# Altium schematic sheet BSPD.SchDoc
size A4
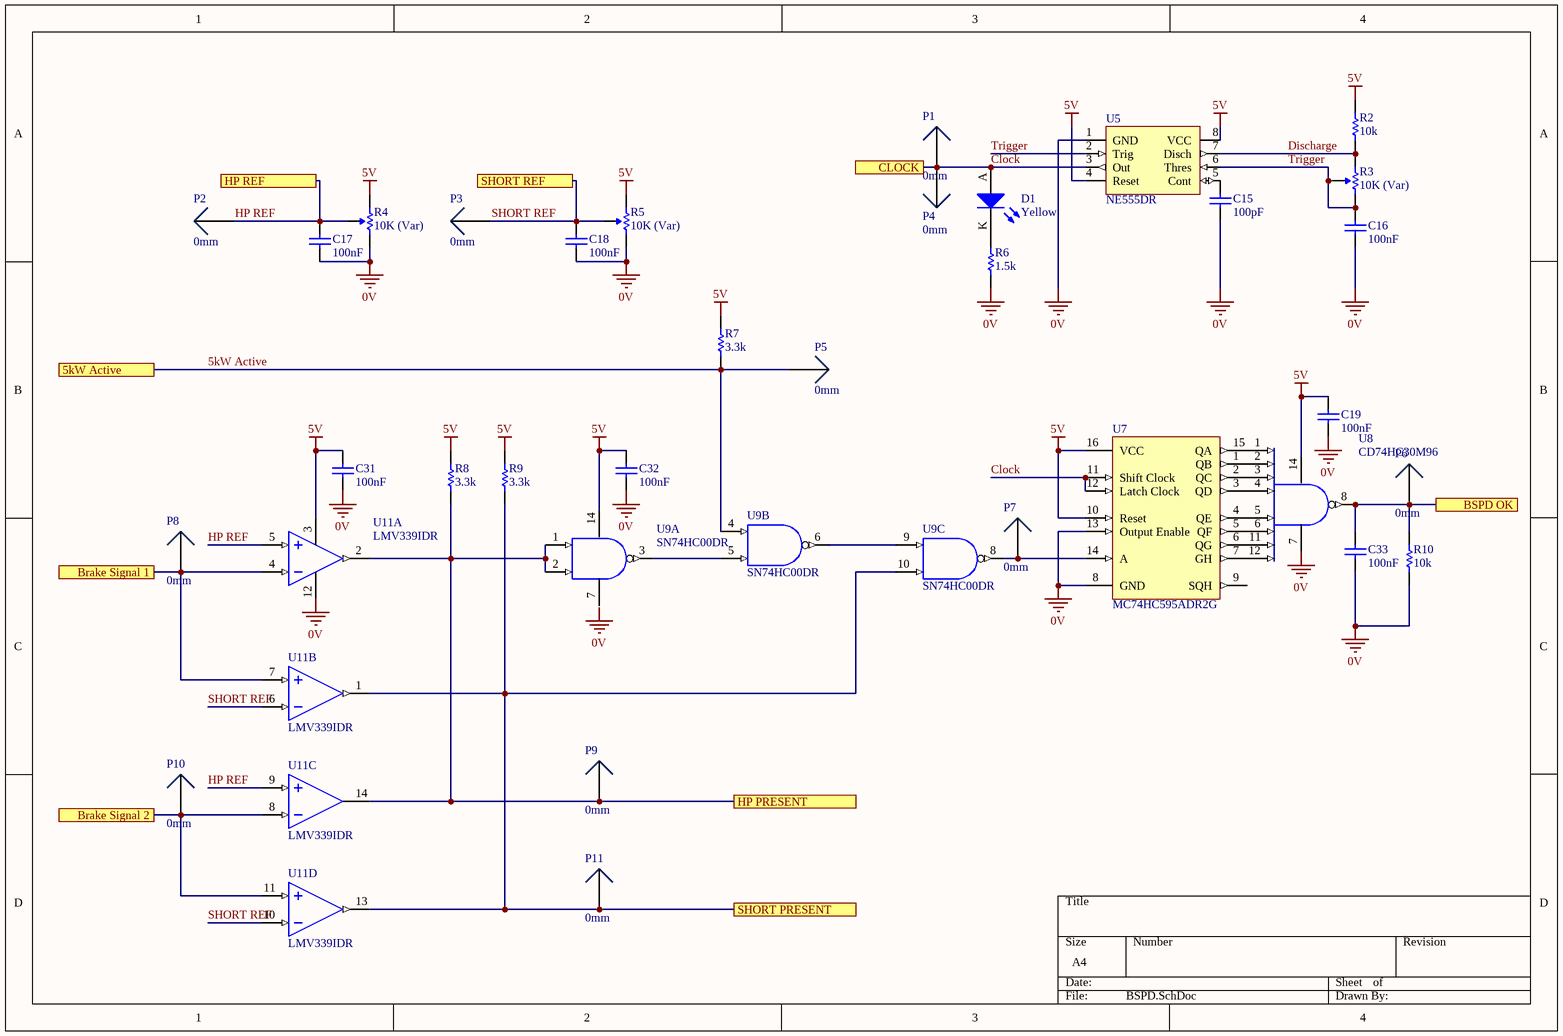
[diagram p0: BSPD.SchDoc]

## Parts
C15  100pF  [0805]
C16  100nF  [0805]
C17  100nF  [0805]
C18  100nF  [0805]
C19  100nF  [0805]
C31  100nF  [0805]
C32  100nF  [0805]
C33  100nF  [0805]
D1  Yellow  [0805 LED]
P1  0mm  [SMD Test Point]
P2  0mm  [TH Test Point]
P3  0mm  [TH Test Point]
P4  0mm  [TH Test Point]
P5  0mm  [SMD Test Point]
P6  0mm  [SMD Test Point]
P7  0mm  [SMD Test Point]
P8  0mm  [TH Test Point]
P9  0mm  [SMD Test Point]
P10  0mm  [TH Test Point]
P11  0mm  [SMD Test Point]
R2  10k  [0805]
R3  10K (Var)  [B 3296]
R4  10K (Var)  [B 3296]
R5  10K (Var)  [B 3296]
R6  1.5k  [0805]
R7  3.3k  [0805]
R8  3.3k  [0805]
R9  3.3k  [0805]
R10  10k  [0805]
U5  NE555DR  [TI 8-SOIC]
U7  MC74HC595ADR2G  [ON 16-SOIC]
U8  CD74HC30M96  [TI 14-SOIC]
U9  SN74HC00DR  [TI 14-SOIC]  (parts A,B,C of 4)
U11  LMV339IDR  [TI 14-SOIC]  (parts A,B,C,D of 4)

## Ports
5kW Active, Brake Signal 1, Brake Signal 2, BSPD OK, CLOCK, HP PRESENT, HP REF, SHORT PRESENT, SHORT REF

## Nets
0V: C15.1 C16.1 C17.1 C18.1 C19.1 C31.1 C32.1 C33.1 R4.1(CCW) R5.1(CCW) R6.1 R10.1 U5.1(GND) U7.8(GND) U7.13(Output_Enable) U8.7(GND) U11.12(V-)
5V: C19.2 C31.2 C32.2 R2.2 R4.3(CW) R5.3(CW) R7.2 R8.2 R9.2 U5.4(Reset) U5.8(VCC) U7.10(Reset) U7.16(VCC) U8.14(VCC) U9.14(VCC) U11.3(V+)
5kW Active: P5.1 R7.1 U9.4(2A) ; port 5kW Active
Brake Signal 1: P8.1 U11.4(IN_A-) U11.7(IN_B+) ; port Brake Signal 1
Brake Signal 2: P10.1 U11.8(IN_C-) U11.11(IN_D+) ; port Brake Signal 2
BSPD OK: C33.2 P6.1 R10.2 U8.8(Output) ; port BSPD OK
Clock: D1.A P1.1 P4.1 U5.3(Out) U7.11(Shift_Clock) U7.12(Latch_Clock) ; port CLOCK
Discharge: R2.1 R3.3(CW) U5.7(Disch)
HP PRESENT: P9.1 R8.1 U9.1(1A) U9.2(1B) U11.2(OUT_A) U11.14(OUT_C) ; port HP PRESENT
HP REF: C17.2 P2.1 R4.2(Wiper) U11.5(IN_A+) U11.9(IN_C+) ; port HP REF
SHORT PRESENT: P11.1 R9.1 U9.10(3B) U11.1(OUT_B) U11.13(OUT_D) ; port SHORT PRESENT
SHORT REF: C18.2 P3.1 R5.2(Wiper) U11.6(IN_B-) U11.10(IN_D-) ; port SHORT REF
Trigger: C16.2 R3.1(CCW) R3.2(Wiper) U5.2(Trig) U5.6(Thres)
NetC15_2: C15.2 U5.5(Cont)
NetD1_K: D1.K R6.2
NetP7_1: P7.1 U7.14(A) U9.8(3Y)
NetU7_1: U7.1(QB) U8.2(Input)
NetU7_2: U7.2(QC) U8.3(Input)
NetU7_3: U7.3(QD) U8.4(Input)
NetU7_4: U7.4(QE) U8.5(Input)
NetU7_5: U7.5(QF) U8.6(Input)
NetU7_6: U7.6(QG) U8.11(Input)
NetU7_7: U7.7(GH) U8.12(Input)
NetU7_15: U7.15(QA) U8.1(Input)
NetU9_3: U9.3(1Y) U9.5(2B)
NetU9_6: U9.6(2Y) U9.9(3A)

Not connected (* = marked no-connect by the designer): U7 9(SQH); U9 7(GND)

## Notes on the sheet
- Labels drawn without touching a wire or pin: 0V

## Library data of the parts
C15 = GCM21B5C1H101JA37L: Manufacturer: muRata; Tolerance: 5%; Material: C0G; Rated Voltage: 50V; Part Number: GCM21B5C1H101JA37L; Value: 100pF
C16-C19 C31-C33 = GCM21BR71E104KA37L: Manufacturer: muRata; Tolerance: 10%; Material: X7R; Rated Voltage: 25V; Part Number: GCM21BR71E104KA37L; Value: 100nF
D1 = SML-211YTT86: Yellow LED Indication - Discrete 1.75V 0805 (2012 Metric); Manufacturer: ROHM Semiconductor; Part Number: SML-211YTT86; Colour: Yellow; Digikey Part Number: 511-1293-1-ND; Digikey Link: https://www.digikey.com/product-detail/en/rohm-semiconductor/SML-211YTT86/511-1293-1-ND/637106
P1 P5-P7 P9 P11 = SMD Test Point: Positions: 1; Row Spacing: 0; Flange: No; Contact: NA; Part Number: SMD Test Point; Pitch: 0mm; Angle: 0
P2-P4 P8 P10 = TH Test Point: Positions: 1; Angle: 0; Flange: No; Contact: NA; Part Number: TH Test Point; Pitch: 0mm; Row Spacing: 0mm
R2 R10 = RC0805FR0710KL: Manufacturer: YAGEO; Tolerance: 0.01; Rated Voltage: 0.125W; Part Number: RC0805FR0710KL; Value: 10k; Material: FR-07
R3-R5 = 3296W-1-103LF: Manufacturer: Bournes Inc; Tolerance: 0.1; Rated Voltage: 0.5W; Part Number: 3296W-1-103LF; Value: 10K (Var); Digikey Part Number: 3296W-103LF-ND
R6 = RC0805FR071K5L: Manufacturer: YAGEO; Tolerance: 0.01; Rated Voltage: 0.125W; Part Number: RC0805FR071K5L; Value: 1.5k; Material: FR-07
R7-R9 = RC0805FR073K3L: Manufacturer: YAGEO; Tolerance: 0.01; Rated Voltage: 0.125W; Part Number: RC0805FR073K3L; Value: 3.3k; Material: FR-07
U5 = NE555DR: IC OSC SGL TIMER 100KHZ 8-SOIC; Manufacturer: Texas Instruments; Part Number: NE555DR; Digikey Part Number: 296-6501-1-ND; Digikey Link: https://www.digikey.com.au/product-detail/en/texas-instruments/NE555DR/296-6501-1-ND/372490
U7 = MC74HC595ADR2G: IC SHIFT REGISTR 8BIT 3ST 16SOIC; Manufacturer: ON Semiconductor; Part Number: MC74HC595ADR2G; Digikey Part Number: MC74HC595ADR2GOSCT-ND; Digikey Link: https://www.digikey.com/product-detail/en/on-semiconductor/MC74HC595ADR2G/MC74HC595ADR2GOSCT-ND/1139727
U8 = CD74HC30M96: IC GATE NAND 1CH 8-INP 14SOIC; Manufacturer: Texas Instruments; Part Number: CD74HC30M96; Digikey Part Number: 296-14521-1-ND; Digikey Link: https://www.digikey.com/product-detail/en/texas-instruments/CD74HC30M96/296-14521-1-ND/555580
U9 = SN74HC00DR: NAND Gate IC 4 Channel 14-SOIC; Manufacturer: Texas Instruments; Part Number: SN74HC00DR; Digikey Part Number: 296-1187-2-ND; Digikey Link: https://www.digikey.com.au/product-detail/en/texas-instruments/SN74HC00DR/296-1187-2-ND/276830
U11 = LMV339IDR: Comparator General Purpose Open Collector 14-SOIC; Manufacturer: Texas Instruments; Part Number: LMV339IDR; Digikey Part Number: 296-6611-2-ND; Digikey Link: https://www.digikey.com/product-detail/en/texas-instruments/LMV339MTX-NOPB/296-35446-1-ND/3739150